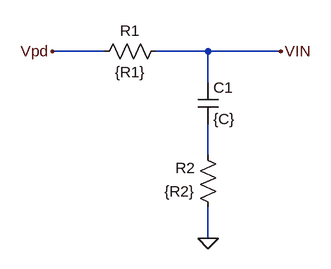
[diagram p0: schematic pfd_loop_filter.asc]
pfd_loop_filter.asc, the LTspice schematic file:
Version 4
SHEET 1 6384 2884
WIRE 16 1152 -64 1152
WIRE 176 1152 96 1152
WIRE 288 1152 176 1152
WIRE 176 1200 176 1152
WIRE 176 1312 176 1264
WIRE 176 1440 176 1392
FLAG -64 1152 Vpd
FLAG 176 1440 0
FLAG 288 1152 VIN
SYMBOL res 112 1136 R90
WINDOW 0 0 56 VBottom 2
WINDOW 3 32 56 VTop 2
SYMATTR InstName R1
SYMATTR Value {R1}
SYMBOL res 192 1408 R180
WINDOW 0 36 76 Left 2
WINDOW 3 36 40 Left 2
SYMATTR InstName R2
SYMATTR Value {R2}
SYMBOL cap 160 1200 R0
SYMATTR InstName C1
SYMATTR Value {C}

The netlist it stands for:
* pfd_loop_filter.asc
R1 VIN Vpd {R1}
R2 0 N001 {R2}
C1 VIN N001 {C}
.backanno
.end